# EAGLE design Reflow Oven V1.1 (EAGLE 6.5.0)
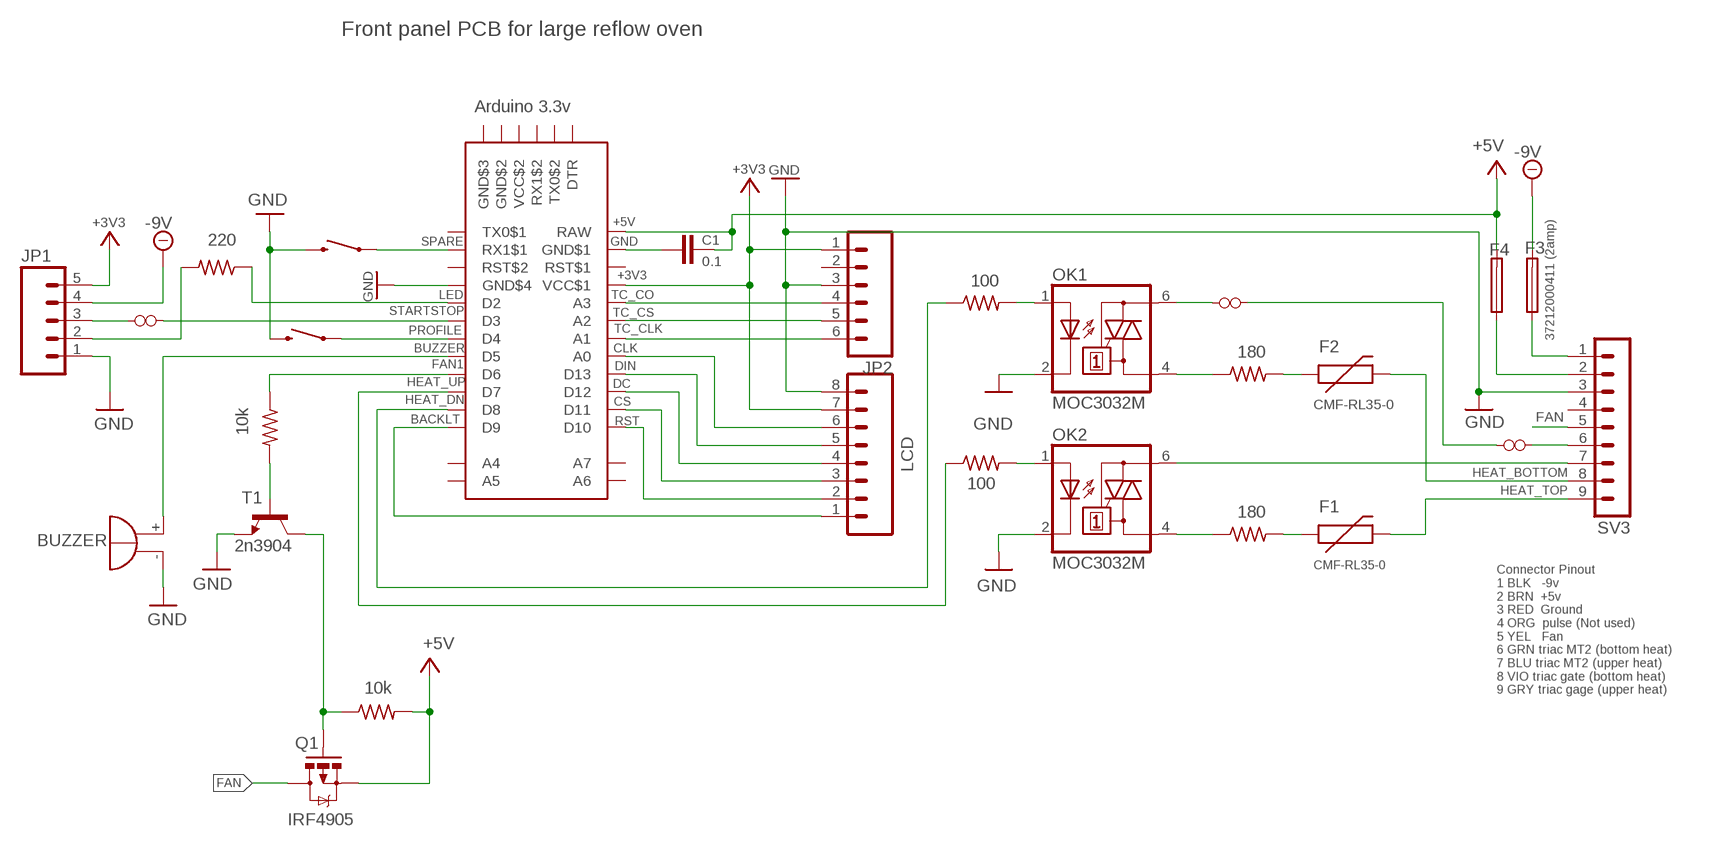
[diagram p0: schematic, sheet 1]

## Parts
BUZZER  F/HMB  [F/HMB]
C1  0.1  CAPPTH  [CAP-PTH-SMALL]
F1  CMF-RL35-0  PTCPTH  [PTC]
F2  CMF-RL35-0  PTCPTH  [PTC]
F3  37212000411 (2amp)  19560  [19560]
F4  37212000411 (2amp)  19560  [19560]
JP1  M05PTH  [1X05]
JP2  M06SIP  [1X06]
LCD  M081X08  [1X08]
OK1  MOC3032M  [DIL06]
OK2  MOC3032M  [DIL06]
PROFILE  SWITCH-MOMENTARY-2PTH  [TACTILE-PTH]
Q1  IRF4905  MOSFET-PCHANNELFQP27P06  [TO220V]
R2  100  R-US_0207/10  [0207/10]
R3  180  R-US_0207/12  [0207/12]
R4  180  R-US_0207/12  [0207/12]
R5  100  R-US_0207/10  [0207/10]
R11  10k  R-US_0207/10  [0207/10]
R12  220  R-US_0207/10  [0207/10]
R13  10k  R-US_0207/10  [0207/10]
SPARE  SWITCH-MOMENTARY-2PTH  [TACTILE-PTH]
SV3  MA09-1  [MA09-1]
T1  2n3904  2N3904-NPN-TO92-EBC  [TO92-EBC]
U$1  JUMPER0.3_INCH  [JUMPER_0.3]
U$2  Arduino 3.3v  ARDUINO_PRO_MINI  [ARDUINO_PRO_MINI]
U$4  JUMPER0.3_INCH  [JUMPER_0.3]
U$5  JUMPER0.7INCH  [JUMPER_0.7]

## Nets
+3V3: JP1.5 JP2.1 LCD.7 U$2.VCC$1
+5V: C1.1 F4.2 Q1.3(S) R13.2 U$2.RAW
-9V: F3.2 JP1.4
BACKLT: LCD.1 U$2.D9
BUZZER: BUZZER.+ U$2.D5
CLK: LCD.6 U$2.A0
CS: LCD.3 U$2.D11
DC: LCD.4 U$2.D12
DIN: LCD.5 U$2.D13
F_GATE: Q1.1(G) R13.1 T1.C
FAN: Q1.2(D) SV3.5
FAN1: R11.1 U$2.D6
GND: BUZZER.- JP1.1 JP2.3 LCD.8 OK1.2(C) OK2.2(C) PROFILE.3 SPARE.3 SV3.3 T1.E U$2.GND$4
GND2: C1.2 U$2.GDN$1(GND$1)
HEAT_BOTTOM: F2.P$2 SV3.8
HEAT_DN: R5.1 U$2.D8
HEAT_TOP: F1.P$2 SV3.9
HEAT_UP: R2.1 U$2.D7
LED: R12.1 U$2.D2
N$1: OK1.4(A1) R3.1
N$2: OK2.6(A2) SV3.7
N$3: F2.P$1 R3.2
N$4: F4.1 SV3.2
N$5: F1.P$1 R4.2
N$6: OK2.4(A1) R4.1
N$7: U$1.P$1 U$5.P$2
N$8: SV3.6 U$1.P$2
N$9: OK1.1(A) R5.2
N$10: OK1.6(A2) U$5.P$1
N$11: OK2.1(A) R2.2
N$12: JP1.3 U$4.P$1
N$13: F3.1 SV3.1
N$20: R11.2 T1.B
N$22: JP1.2 R12.2
PROFILE: PROFILE.1 U$2.D4
RST: LCD.2 U$2.D10
SPARE: SPARE.1 U$2.RX1$1
STARTSTOP: U$2.D3 U$4.P$2
TC_CLK: JP2.6 U$2.A1
TC_CO: JP2.4 U$2.A3
TC_CS: JP2.5 U$2.A2
Unconnected: JP2.2 SV3.4 U$2.A4 U$2.A5 U$2.A6 U$2.A7 U$2.DTR U$2.RST$1 U$2.RST$2 U$2.RX1$2 U$2.TX0$1 U$2.TX0$2

## Notes on the sheet
- Front panel PCB for large reflow oven
- Connector Pinout
  1 BLK   -9v
  2 BRN  +5v
  3 RED  Ground
  4 ORG  pulse (Not used)
  5 YEL   Fan
  6 GRN triac MT2 (bottom heat)
  7 BLU triac MT2 (upper heat)
  8 VIO triac gate (bottom heat)
  9 GRY triac gage (upper heat)

## Power pins joined to a net without a drawn wire
GND$2: U$2.GND$2
GND$3: U$2.GND$3
VCC$2: U$2.VCC$2

## Library data of the parts
BUZZER = buzzer:F/HMB: BUZZER Source: Buerklin; OC_FARNELL: unknown; OC_NEWARK: unknown
C1 = SparkFun-Capacitors:CAP: Capacitor Standard 0603 ceramic capacitor, and 0.1" leaded capacitor.
F1 F2 = SparkFun-PowerIC:PTC: Resettable Fuse PTC Resettable Fuse. Spark Fun Electronics SKU : COM-08357
F3 F4 = fuse:19560: FUSE HOLDER TR5, Wickmann; MPN: 56000001009; OC_FARNELL: 1185363; OC_NEWARK: 15P8392
JP1 = SparkFun-Connectors:M05: Header 5 Standard 5-pin 0.1" header. Use with straight break away headers (SKU : PRT-00116), right angle break away headers (PRT-00553), swiss pins (PRT-00743), machine pins (PRT-00117), and female headers (PRT-00115). Molex polarized connector foot print use with SKU : PRT-08230 with associated crimp pins and housings.
JP2 = SparkFun-Connectors:M06: Header 6 Standard 6-pin 0.1" header. Use with straight break away headers (SKU : PRT-00116), right angle break away headers (PRT-00553), swiss pins (PRT-00743), machine pins (PRT-00117), and female headers (PRT-00115). Molex polarized connector foot print use with SKU : PRT-08094 with associated crimp pins and housings. NOTES ON THE VARIANTS LOCK and LOCK_LONGPADS... This footprint was designed to help hold the alignment of a through-hole component (i.e. 6-pin header) while soldering it into place. You may notice that each hole has been shifted either up or down by 0.005 of an inch from it's more standard position (which is a perfectly straight line). This slight alteration caused the pins (the squares in the middle) to touch the edges of the holes. Because they are alternating, it causes a "brace" to hold the component in place. 0.005 has proven to be the perfect amount of "off-center" position when using our standard breakaway headers. Although looks a little odd when you look at the bare footprint, once you have a header in there, the alteration is very hard to notice. Also,if you push a header all the way into place, it is covered up entirely on the bottom side. This idea of altering the position of holes to aid alignment will be further integrated into the Sparkfun Library for other footprints. It can help hold any component with 3 or more connection pins.
LCD = SparkFun-Connectors:M08: Header 8 Standard 8-pin 0.1" header. Use with straight break away headers (SKU : PRT-00116), right angle break away headers (PRT-00553), swiss pins (PRT-00743), machine pins (PRT-00117), and female headers (PRT-00115).
OK1 OK2 = optocoupler:MOC30*: 6-Pin DIP Zero-Cross Optoisolators Triac Driver Output (250/400 Volt Peak) Source: Data sheet <http://www.fairchildsemi.com/ds/MO/MOC3031M.pdf> The old path of data sheet not more available 2013-05-06.; MF: FAIRCHILD SEMICONDUCTOR; MPN: MOC3032-M; OC_FARNELL: 1203802; OC_NEWARK: 72K8897
PROFILE SPARE = SparkFun-Electromechanical:SWITCH-MOMENTARY-2: Various NO switches- pushbuttons, reed, etc
Q1 = SparkFun-DiscreteSemi:MOSFET-PCHANNEL: Generic PMOSFET IRLML2244 - TRANS-11153 (SOT-23 -20V -4.3A) (1.Gate 2.Source 3.Drain) FQP27P06 - COM-10349 <http://www.sparkfun.com/products/10349> (TO-220 -60V -27A) (1.Gate 2.Source 3.Drain)
R2-R5 R11-R13 = rcl:R-US_: RESISTOR, American symbol
SV3 = con-lstb:MA09-1: PIN HEADER; OC_FARNELL: unknown; OC_NEWARK: unknown
T1 = transistor-neu-to92:*-NPN-: NPN Transistror
U$1 U$4 U$5 = SRG:JUMPER
U$2 = SRG:ARDUINO_PRO_MINI: Arduino Pro-Mini Made by Sparkfun Comes in 3.3 volt <http://www.sparkfun.com/products/11113> and 5 volt <http://www.sparkfun.com/products/11114> versions Note: A6 & A7 are analog in only

## Net classes
0 default: width 0.406 mm, drill 0.254 mm, clearance 0.635 mm

## Board
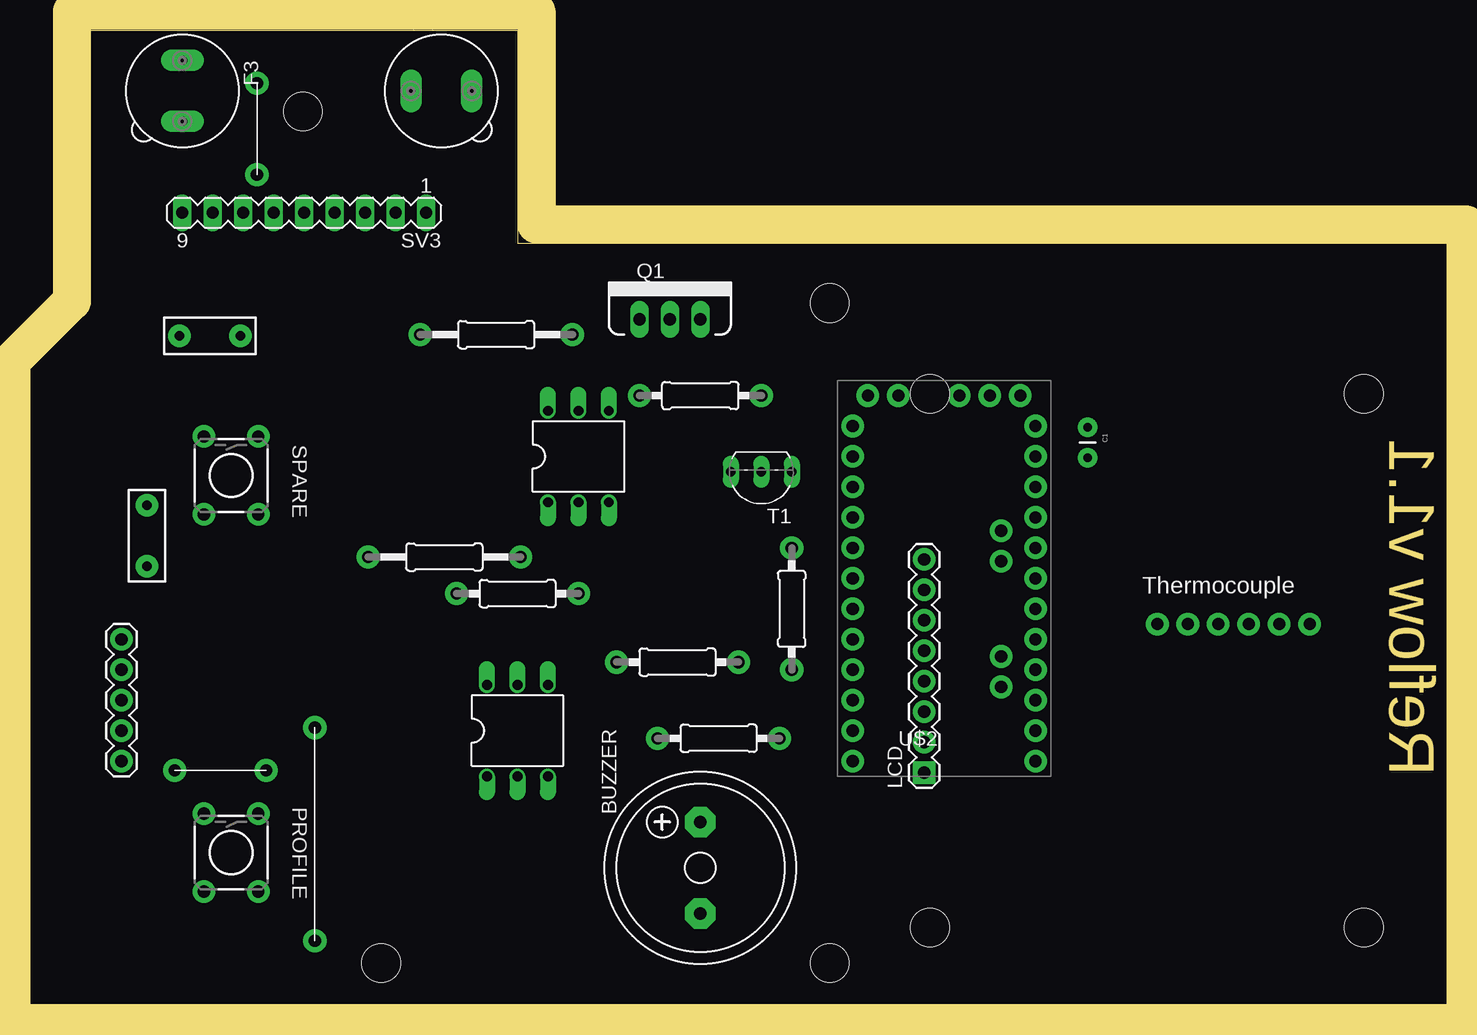
[diagram p1: board, top side]
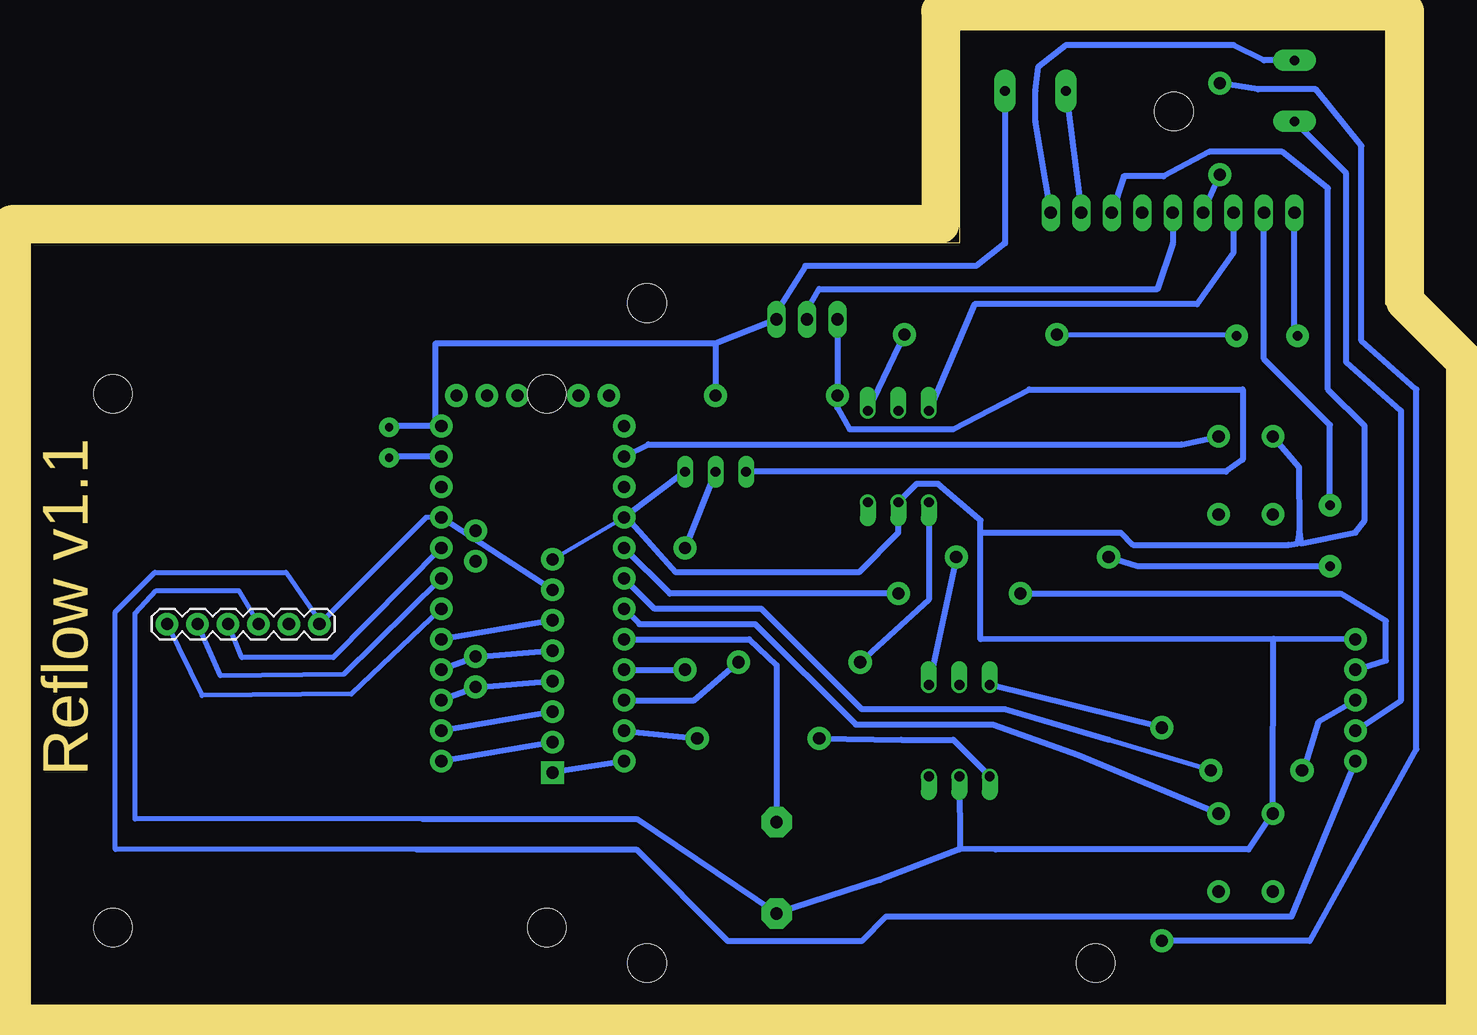
[diagram p2: board, bottom side, seen from below]

Size 118.11 x 81.28 mm. Coordinates in mm from the lower left corner, seen from the top.
Outline: 5.08,81.28 40.64,81.28 40.64,63.5 118.11,63.5 118.11,0 0,0 0,53.34 5.08,58.42 5.08,81.28
Copper layers (1*16): Top 0.035mm / dielectric 1.5mm / Bottom 0.035mm
Design rules "ShapeOko": minimum track width 12mil, minimum drill 24mil, track to track 25mil, track to pad 25mil, pad to pad 25mil, via to via 25mil, smd to smd 25mil, copper to edge 40mil, drill to drill 8mil, minimum pad ring 10mil, minimum via ring 8mil, stop-mask expansion 4mil, vias tented up to drill 0mil, thermal gap 10mil
Holes 3.2 mm at 22.76,74.49 29.27,3.49 66.67,58.51 66.67,3.49 75.02,50.94 111.19,50.94 111.19,6.46 75.02,6.46
Milling: 8 lines

### Footprints (pad centres in the part's own frame; a part is rotated, then mirrored left to right if it is on the bottom)
F/HMB = drill 1.016 pad 2.54 octagon: + 3.81,0; - -3.81,0
CAP-PTH-SMALL = drill 0.7 pad 1.651: 1 0,0; 2 2.54,0
PTC = drill 0.8 pad 1.88: P$1 -2.54,0; P$2 2.54,0
19560 = drill 0.813 pad 1.778 long: 1 -2.54,0; 2 2.54,0
1X05 = drill 1.016 pad 1.88: 1 0,0; 2 2.54,0; 3 5.08,0; 4 7.62,0; 5 10.16,0
1X06 = drill 1.016 pad 1.88: 1 0,0; 2 2.54,0; 3 5.08,0; 4 7.62,0; 5 10.16,0; 6 12.7,0
1X08 = drill 1.016 pad 1.88 square: 1 0,0 | drill 1.016 pad 1.88: 2 2.54,0; 3 5.08,0; 4 7.62,0; 5 10.16,0; 6 12.7,0; 7 15.24,0; 8 17.78,0
DIL06 = drill 0.813 offset: 1 -2.54,-3.81; 2 0,-3.81; 3 2.54,-3.81; 4 2.54,3.81; 5 0,3.81; 6 -2.54,3.81
TACTILE-PTH = drill 1.016 pad 1.88: 1 -3.251,2.261; 2 3.251,2.261; 3 -3.251,-2.261; 4 3.251,-2.261
TO220V = drill 1.016 long: 1 -2.54,0; 2 0,0; 3 2.54,0
0207/10 = drill 1.016 pad 1.93: 1 -5.08,0; 2 5.08,0
0207/12 = drill 1.016 pad 1.93: 1 -6.35,0; 2 6.35,0
MA09-1 = drill 1.016 long: 1 -10.16,0; 2 -7.62,0; 3 -5.08,0; 4 -2.54,0; 5 0,0; 6 2.54,0; 7 5.08,0; 8 7.62,0; 9 10.16,0
TO92-EBC = drill 0.813 long: B 0,-1.27; C 2.54,-1.27; E -2.54,-1.27
JUMPER_0.3 = drill 1.016 pad 1.93: P$1 0,0; P$2 7.62,0
ARDUINO_PRO_MINI = drill 1.016 pad 1.88: A0 7.62,-5.08; A1 7.62,-2.54; A2 7.62,0; A3 7.62,2.54; A4 4.763,1.429; A5 4.763,3.969; A6 4.763,-9.049; A7 4.763,-6.509; D2 -7.62,2.54; D3 -7.62,0; D4 -7.62,-2.54; D5 -7.62,-5.08; D6 -7.62,-7.62; D7 -7.62,-10.16; D8 -7.62,-12.7; D9 -7.62,-15.24; D10 7.62,-15.24; D11 7.62,-12.7; D12 7.62,-10.16; D13 7.62,-7.62; DTR 6.35,15.24; GDN$1 7.62,10.16; GND$2 -3.81,15.24; GND$3 -6.35,15.24; GND$4 -7.62,5.08; RAW 7.62,12.7; RST$1 7.62,7.62; RST$2 -7.62,7.62; RX1$1 -7.62,10.16; RX1$2 1.27,15.24; TX0$1 -7.62,12.7; TX0$2 3.81,15.24; VCC$1 7.62,5.08; VCC$2 -1.27,15.24
JUMPER_0.7 = drill 1.016 pad 1.93: P$1 -8.89,0; P$2 8.89,0

### Placement (x,y rotation side)
BUZZER  55.88,11.43 90 top
C1  88.17,48.15 270 top
F1  14.99,55.79 180 top
F2  9.74,39.11 90 top
F3  12.7,76.2 270 top
F4  34.29,76.2 0 top
JP1  7.62,30.48 270 top
JP2  93.98,31.75 180 bottom
LCD  74.55,19.36 90 top
OK1  40.64,22.86 0 top
OK2  45.72,45.72 0 top
PROFILE  16.76,12.7 270 top
Q1  53.34,57.15 0 top
R2  53.98,28.57 180 top
R3  34.54,37.34 180 top
R4  38.86,55.88 180 top
R5  57.4,22.23 180 top
R11  63.5,33.02 90 top
R12  40.64,34.29 180 top
R13  55.88,50.8 0 top
SPARE  16.76,44.15 270 top
SV3  22.86,66.04 180 top
T1  60.96,43.18 180 top
U$1  18.92,76.83 270 top
U$2  76.2,35.56 0 top
U$4  12.06,19.56 0 top
U$5  23.75,14.22 270 top

### Tracks (layer width: path | path; a pad name or v marks a point on that pad's centre or on a via)
+3V3
  Bottom 0.406: U$2.VCC$1 85.09,40.64 JP2.1 93.98,32 96.77,36.07 107.7,36.07 111,32.77 111,12.95 85.85,12.95
  Bottom 0.508: LCD.7 U$2.VCC$1 | 85.85,12.95 67.56,12.95 59.94,5.33 48.77,5.33 46.74,7.37 12.95,7.37 JP1.5
+5V
  Bottom 0.508: 84.33,48.26 88.14,48.26 C1.1 | 60.96,55.12 R13.2 | 84.33,48.26 84.33,55.12 60.96,55.12 | 84.33,48.26 U$2.RAW | Q1.3 56.41,56.94 | 56.41,56.94 60.96,55.12 | F4.2 36.83,63.5 39.24,61.59 53.47,61.59 56.41,56.94
-9V
  Bottom 0.508: JP1.4 3.81,25.4 3.81,49.53 8.38,53.59 8.38,69.34 F3.2
BACKLT
  Bottom 0.508: U$2.D9 LCD.1
BUZZER
  Bottom 0.406: 55.88,28.19 55.88,28.32
  Bottom 0.508: U$2.D5 58.17,30.48 55.88,28.32 | 55.88,28.19 BUZZER.+
CLK
  Bottom 0.508: LCD.6 U$2.A0
CS
  Bottom 0.508: LCD.3 U$2.D11
DC
  Bottom 0.508: LCD.4 81.03,26.42 U$2.D12
DIN
  Bottom 0.508: LCD.5 81.03,28.96 U$2.D13
F_GATE
  Bottom 0.508: Q1.1 R13.1 50.8,49.78 49.78,48.01 41.15,48.01 34.8,51.31 17.02,51.31 17.02,45.47 18.41,44.45 T1.C
FAN
  Bottom 0.508: Q1.2 53.34,57.91 52.32,59.69 24.13,59.69 22.86,63.5 SV3.5
FAN1
  Bottom 0.508: U$2.D6 R11.1
GND
  Bottom 0.381: U$2.GND$4 LCD.8
  Bottom 0.406: 38.86,40.39 38.99,40.49 | 12.45,38.48 12.31,39.44 | 40.64,12.95 40.59,13.01 | JP2.3 100.71,34.54 107.57,34.54 109.35,32.64 109.35,15.49 85.34,15.49
  Bottom 0.508: 7.87,30.48 JP1.1 14.46,30.52 | T1.E U$2.GND$4 68.33,40.64 64.26,36.07 49.02,36.07 45.72,39.37 OK2.2 44.2,43.43 42.42,43.43 38.99,40.49 | SV3.3 26.92,69.09 23.62,69.09 19.81,71.12 13.72,71.12 9.91,68.07 9.91,51.31 6.86,48.26 6.86,40.39 7.62,39.37 12.19,38.48 12.31,39.44 12.32,44.83 SPARE.3 | 14.46,30.52 38.86,30.48 38.86,39.37 | 38.86,39.37 38.86,40.39 | 14.46,30.52 PROFILE.3 16.51,12.95 37.59,12.95 40.59,13.01 OK1.2 | 85.34,15.49 67.56,15.49 BUZZER.- 47.24,10.41 40.64,12.95 | 12.45,38.48 13.21,38.35 26.16,38.35 27.18,39.37 38.86,39.37
GND2
  Bottom 0.508: U$2.GDN$1 88.14,45.72 C1.2
HEAT_BOTTOM
  Bottom 0.508: SV3.8 15.24,53.85 9.74,48.35 F2.P$2
HEAT_DN
  Bottom 0.508: U$2.D8 R5.1
HEAT_TOP
  Bottom 0.406: 12.7,55.88 F1.P$2
  Bottom 0.508: 12.7,55.88 SV3.9
HEAT_UP
  Bottom 0.508: R2.1 62.74,25.4 U$2.D7
LED
  Bottom 0.508: U$2.D2 64.77,34.29 R12.1
N$1
  Bottom 0.508: R3.1 OK1.4
N$2
  Bottom 0.508: OK2.6 39.37,58.42 20.83,58.42 17.78,62.74 SV3.7
N$3
  Bottom 0.406: 9.91,36.58 F2.P$1
  Bottom 0.508: 9.91,36.58 25.78,36.58 R3.2
N$4
  Bottom 0.508: F4.1 SV3.2
N$5
  Bottom 0.406: R4.2 17.78,55.88 F1.P$1
N$6
  Bottom 0.508: R4.1 OK2.4
N$7
  Bottom 0.508: U$5.P$2 11.43,5.33 2.54,21.34 2.54,51.31 7.11,55.37 7.11,71.63 10.92,76.33 15.75,76.33 U$1.P$1
N$8
  Bottom 0.508: U$1.P$2 SV3.6
N$9
  Bottom 0.508: R5.2 45.47,22.1 41.15,22.1 OK1.1
N$10
  Bottom 0.508: U$5.P$1 OK1.6
N$11
  Bottom 0.508: OK2.1 43.18,33.78 R2.2
N$12
  Bottom 0.406: 11.94,19.56 U$4.P$1
  Bottom 0.508: JP1.3 10.67,23.62 11.94,19.56
N$13
  Bottom 0.508: F3.1 15.24,78.74 17.78,80.01 31.75,80.01 34.04,78.23 34.29,76.2 34.29,73.66 SV3.1
N$20
  Bottom 0.508: T1.B R11.2
N$22
  Bottom 0.508: JP1.2 5.08,28.7 5.08,32 8.89,34.29 R12.2
PROFILE
  Bottom 0.508: U$2.D4 67.31,31.75 57.66,31.75 49.28,23.37 37.85,23.37 30.73,20.83 PROFILE.1
RST
  Bottom 0.508: LCD.2 U$2.D10
SPARE
  Bottom 0.508: SPARE.1 22.1,46.74 66.55,46.74 U$2.RX1$1
STARTSTOP
  Bottom 0.406: U$4.P$2 28.19,22.1
  Bottom 0.508: U$2.D3 66.04,33.02 57.15,33.02 48.77,24.64 36.83,24.64 28.19,22.1
TC_CLK
  Bottom 0.406: JP2.6 103.76,25.78 91.31,25.91 U$2.A1
TC_CO
  Bottom 0.406: JP2.4 100.46,28.96 92.84,28.96 U$2.A3
TC_CS
  Bottom 0.406: JP2.5 102.23,27.43 91.95,27.56 U$2.A2

### Text on the board
tPlace: Thermocouple
Milling: Reflow v1.1